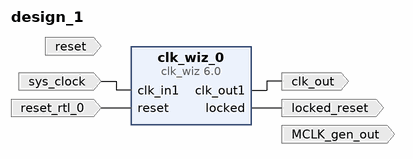
[diagram p0: block diagram of the top level]
# Vivado block design design_1, xc7a100tcsg324-1, Vivado 2018.2
create_bd_design design_1

create_bd_port -dir I -type clk sys_clock
set_property -dict {CONFIG.FREQ_HZ 100000000 CONFIG.PHASE 0.000} [get_bd_ports sys_clock]
create_bd_port -dir I -type rst reset
set_property -dict {CONFIG.POLARITY ACTIVE_LOW} [get_bd_ports reset]
create_bd_port -dir O locked_reset
create_bd_port -dir O -type clk clk_out
create_bd_port -dir O -type clk MCLK_gen_out
create_bd_port -dir I -type rst reset_rtl_0
set_property -dict {CONFIG.POLARITY ACTIVE_HIGH} [get_bd_ports reset_rtl_0]

create_bd_cell -type ip -vlnv xilinx.com:ip:clk_wiz:6.0 clk_wiz_0
set_property -dict [list \
  CONFIG.CLKOUT2_USED true \
  CONFIG.NUM_OUT_CLKS 2 \
  CONFIG.CLKOUT2_REQUESTED_OUT_FREQ 18.4320 \
  CONFIG.MMCM_DIVCLK_DIVIDE 1 \
  CONFIG.MMCM_CLKFBOUT_MULT_F 10.875 \
  CONFIG.MMCM_CLKOUT0_DIVIDE_F 10.875 \
  CONFIG.MMCM_CLKOUT1_DIVIDE 59 \
  CONFIG.CLKOUT1_JITTER 122.755 \
  CONFIG.CLKOUT1_PHASE_ERROR 92.529 \
  CONFIG.CLKOUT2_JITTER 175.761 \
  CONFIG.CLKOUT2_PHASE_ERROR 92.529 \
] [get_bd_cells clk_wiz_0]

# ---- connections ----

connect_bd_net [get_bd_ports sys_clock] [get_bd_pins clk_wiz_0/clk_in1]
# net reset_1 has one end: reset
connect_bd_net [get_bd_pins clk_wiz_0/locked] [get_bd_ports locked_reset]
connect_bd_net [get_bd_pins clk_wiz_0/clk_out1] [get_bd_ports clk_out]
# net clk_wiz_0_MCLK has one end: MCLK_gen_out
connect_bd_net -net reset_rtl_0_1 [get_bd_ports reset_rtl_0] [get_bd_pins clk_wiz_0/reset]

validate_bd_design
save_bd_design
